# Altium schematic sheet [16]-SP1_TYPEC_PWR_IN.SchDoc: RK3399 SOM Board Design V1.0
size A4; Author: AVIRAL MISHRA; DocumentNumber: 18; SheetNumber: 18; SheetTotal: 21; PROJECT CODE: A_V1.0
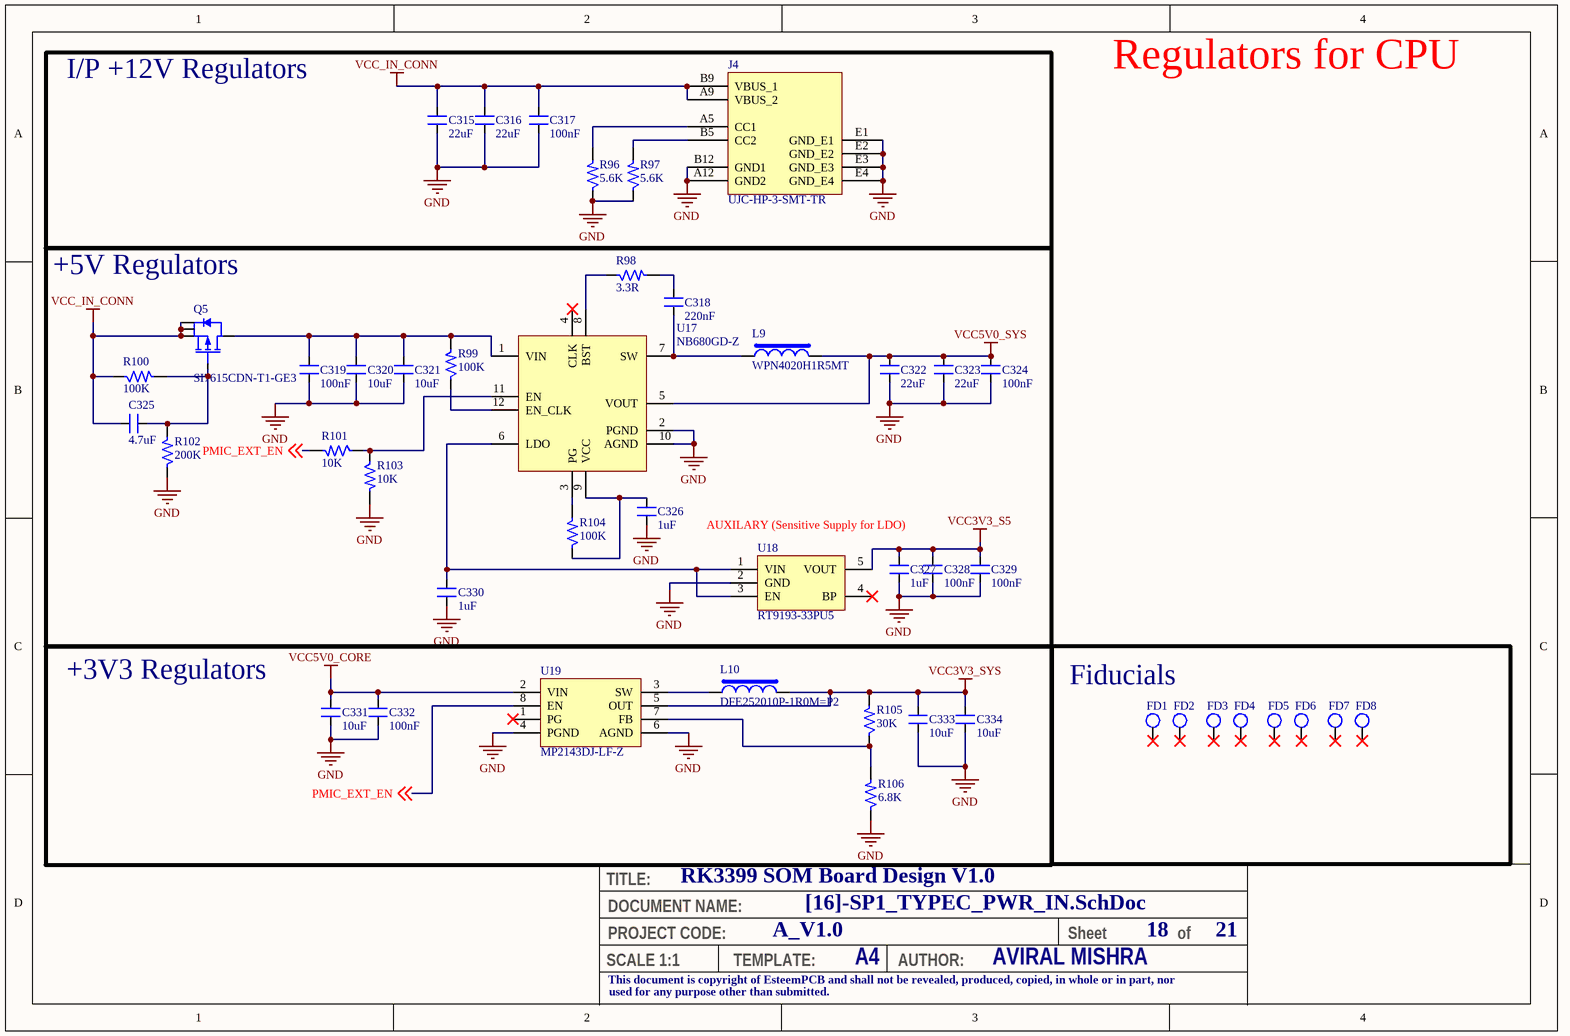
[diagram p0: [16]-SP1_TYPEC_PWR_IN.SchDoc]

## Parts
C315  22uF  [CAP_0603]
C316  22uF  [CAP_0603]
C317  100nF  [CAP_0402]
C318  220nF  [CAP_0402]
C319  100nF  [CAP_0402]
C320  10uF  [CAP_0402]
C321  10uF  [CAP_0402]
C322  22uF  [CAP_0603]
C323  22uF  [CAP_0603]
C324  100nF  [CAP_0402]
C325  4.7uF  [CAP_0402]
C326  1uF  [CAP_0402]
C327  1uF  [CAP_0402]
C328  100nF  [CAP_0402]
C329  100nF  [CAP_0402]
C330  1uF  [CAP_0402]
C331  10uF  [CAP_0402]
C332  100nF  [CAP_0402]
C333  10uF  [CAP_0402]
C334  10uF  [CAP_0402]
FD1  Fiducial  [FIDUCIAL_78.7MIL]  (value not drawn)
FD2  Fiducial  [FIDUCIAL_78.7MIL]  (value not drawn)
FD3  Fiducial  [FIDUCIAL_78.7MIL]  (value not drawn)
FD4  Fiducial  [FIDUCIAL_78.7MIL]  (value not drawn)
FD5  Fiducial  [FIDUCIAL_78.7MIL]  (value not drawn)
FD6  Fiducial  [FIDUCIAL_78.7MIL]  (value not drawn)
FD7  Fiducial  [FIDUCIAL_78.7MIL]  (value not drawn)
FD8  Fiducial  [FIDUCIAL_78.7MIL]  (value not drawn)
J4  UJC-HP-3-SMT-TR  [CON6_48.4_UJC-HP-3-SMT-TR]
L9  WPN4020H1R5MT  [IND_1616]
L10  DFE252010P-1R0M=P2  [IND_1008]
Q5  SI7615CDN-T1-GE3  [PowerPAK_1212-8_SMD]
R96  5.6K  [RES_0402]
R97  5.6K  [RES_0402]
R98  3.3R  [RES_0402]
R99  100K  [RES_0402]
R100  100K  [RES_0402]
R101  10K  [RES_0402]
R102  200K  [RES_0402]
R103  10K  [RES_0402]
R104  100K  [RES_0402]
R105  30K  [RES_0402]
R106  6.8K  [RES_0402]
U17  NB680GD-Z  [QFN-12_19_118X118_SMD]
U18  RT9193-33PU5  [SC70-5]
U19  MP2143DJ-LF-Z  [SOT23-8]

## Blocks framed on the sheet
I/P +12V Regulators: C315-C317 J4 R96 R97
+5V Regulators: C318-C330 L9 Q5 R98-R104 U17 U18
+3V3 Regulators: C331-C334 L10 R105 R106 U19
Fiducials: FD1-FD8

## Nets
GND: C315.1 C316.1 C317.1 C319.1 C320.1 C321.1 C322.1 C323.1 C324.1 C326.1 C327.1 C328.1 C329.1 C330.1 C331.1 C332.1 C333.1 C334.1 J4.A12(GND2) J4.B12(GND1) J4.E1(GND_E1) J4.E2(GND_E2) J4.E3(GND_E3) J4.E4(GND_E4) R96.1 R97.1 R102.1 R103.2 R106.1 U17.2(PGND) U17.10(AGND) U18.2(GND) U19.4(PGND) U19.6(AGND)
VCC3V3_S5: C327.2 C328.2 C329.2 U18.5(VOUT)
VCC3V3_SYS: C333.2 C334.2 L10.2 R105.2 U19.5(OUT)
VCC5V0_CORE: C331.2 C332.2 U19.2(VIN)
VCC5V0_SYS: C322.2 C323.2 C324.2 L9.2 U17.5(VOUT)
VCC_IN_CONN: C315.2 C316.2 C317.2 C325.1 J4.A9(VBUS_2) J4.B9(VBUS_1) Q5.1(S) Q5.2(S) Q5.3(S) R100.1
PMIC_EXT_EN: R101.2 U19.8(EN) ; off-sheet PMIC_EXT_EN
NetC318_1: C318.1 L9.1 U17.7(SW)
NetC318_2: C318.2 R98.2
NetC319_2: C319.2 C320.2 C321.2 Q5.5(D) R99.2 U17.1(VIN)
NetC325_2: C325.2 Q5.4(G) R100.2 R102.2
NetC326_2: C326.2 R104.1 U17.9(VCC)
NetC330_2: C330.2 U17.6(LDO) U18.1(VIN) U18.3(EN)
NetJ4_A5: J4.A5(CC1) R96.2
NetJ4_B5: J4.B5(CC2) R97.2
NetL10_1: L10.1 U19.3(SW)
NetR98_1: R98.1 U17.8(BST)
NetR99_1: R99.1 U17.12(EN_CLK)
NetR101_1: R101.1 R103.1 U17.11(EN)
NetR104_2: R104.2 U17.3(PG)
NetR105_1: R105.1 R106.2 U19.7(FB)

Not connected (* = marked no-connect by the designer): FD1 1*; FD2 1*; FD3 1*; FD4 1*; FD5 1*; FD6 1*; FD7 1*; FD8 1*; U17 4(CLK)*; U18 4(BP)*; U19 1(PG)*

## Notes on the sheet
- Regulators for CPU
- AUXILARY (Sensitive Supply for LDO)
- TITLE:
- DOCUMENT NAME:
- SCALE 1:1
- This document is copyright of EsteemPCB and shall not be revealed, produced, copied, in whole or in part, nor
- PROJECT CODE:
- TEMPLATE:
- A4
- AUTHOR:
- Sheet
- of
- used for any purpose other than submitted.

## Library data of the parts
C315 C316 C322 C323 = CAP_22uF-10V-20%-0603: 22µF ±20% 10V Ceramic Capacitor X5R 0603 (1608 Metric) /; Manufacturer: Murata Electronics; Manufacturer Part Number: GRM188R61A226ME15D; Case/Package: 0603; Supplier-1: Digikey
C317 C319 C324 C328 C329 C332 = CAP_100nF-25V-10%-0402: 0.1µF ±10% 25V Ceramic Capacitor X7R 0402 (1005 Metric) /; Manufacturer: Walsin Technology Corporation; Manufacturer Part Number: 0402B104K250CT; Case/Package: 0402; Supplier-1: Digikey
C318 = CAP_220nF-10V-10%-0402: 0.22µF ±10% 10V Ceramic Capacitor X7R 0402 (1005 Metric) /; Manufacturer: Samsung Electro-Mechanics; Manufacturer Part Number: CL05B224KP5NNNC; Case/Package: 0402; Supplier-1: Digikey
C320 C321 C331 C333 C334 = CAP_10uF-10V-20%-0402: 10µF ±20% 10V Ceramic Capacitor X5R 0402 (1005 Metric) /; Manufacturer Part Number: CL05A106MP5NUNC; Manufacturer: Samsung Electro-Mechanics; Case/Package: 0402; Supplier-1: Digikey
C325 = CAP_4.7uF-10V-10%-0402: 4.7µF ±10% 10V Ceramic Capacitor X5R 0402 (1005 Metric) /; Manufacturer: Samsung Electro-Mechanics; Manufacturer Part Number: CL05A475KP5NRNC; Case/Package: 0402; Supplier-1: Digikey
C326 C327 C330 = CAP_1uF-16V-10%-0402: 1µF ±10% 16V Ceramic Capacitor X5R 0402 (1005 Metric) /; Manufacturer: Knowles Novacap; Manufacturer Part Number: 0402BW105K160YT; Case/Package: 0402; Supplier-1: Digikey
FD1-FD8 = Fiducials_78.7mil: 78.7mil Fiducials SMD; Manufacturer: NA; Nymble Part Number: 1EA-AA-0523; Manufacturer Part Number: NA; Case/Package: SMD; Supplier-1: NA; Supplier Part Number-1: NA; Alternate Part Number-1: NA; Category: Fiducial; Number of Pins: 1
J4 = CON-TYPEC_6X1-100-RA-TH: USB Connectors USB jack, C type, power only, 6 pin, horizonal, gold flash plating, surface mount, T&R; Manufacturer: CUI Devices; Manufacturer Part Number: UJC-HP-3-SMT-TR; Case/Package: TH; Supplier-1: Mouser
L9 = IND_1.5uH-6A-20%-SMD: Wire Wound SMD Power Inductors – WPN Series / Operating Temp. : -40℃~+125℃ (Including self-heating) /; Manufacturer: Sunlord; Mnaufcaturer Part Number: WPN4020H1R5MT; Case/Package: SMD; Supplier-1: NA
L10 = IND_1uH-3.8A-20%-1008: 1µH Shielded Wirewound Inductor 3.8A 54mOhm Max 1008 (2520 Metric) /; Manufacturer: Murata Electronics; Manufacturer Part Number: DFE252010P-1R0M=P2; Case/Package: 1008; Supplier-1: Digikey
Q5 = MOSFET-P_20V-35A-1212-8: P-Channel 20V 35A (Tc) 33W (Tc) Surface Mount PowerPAK® 1212-8 /; Manufacturer: Vishay Siliconix; Manufacturer Part Number: SI7615CDN-T1-GE3; Case/Package: PowerPAK® 1212-8; Supplier-1: Digikey
R96 R97 = RES_5.6K-0.1W-1%-0402: 5.6 kOhms ±1% 0.1W, 1/10W Chip Resistor 0402 (1005 Metric) Automotive AEC-Q200, Moisture Resistant Thick Film /; Manufacturer: KOA Speer Electronics, Inc.; Manufacturer Part Number: RK73H1ETTP5601F; Case/Package: 0402; Supplier-1: Digikey
R98 = RES_3.3R-0.1W-1%-0402: 3.3 Ohms ±1% 0.1W, 1/10W Chip Resistor 0402 (1005 Metric) Anti-Sulfur, Automotive AEC-Q200 Thick Film /; Manufacturer: Panasonic Electronic Components; Manufacturer Part Number: ERJ-U02F3R30X; Case/Package: 0402; Supplier-1: Digikey
R99 R100 R104 = RES_100K-0.1W-1%-0402: 100 kOhms ±1% 0.1W, 1/10W Chip Resistor 0402 (1005 Metric) Anti-Sulfur Thin Film /; Manufacturer: Vishay Beyschlag/Draloric/BC Components; Manufacturer Part Number: MCS04020C1003FE000; Case/Package: 0402; Supplier-1: Digikey
R101 R103 = RES_10K-0.1W-1%-0402: 10 kOhms ±1% 0.1W, 1/10W Chip Resistor 0402 (1005 Metric) Anti-Sulfur Thin Film /; Manufacturer: Vishay Beyschlag/Draloric/BC Components; Manufacturer Part Number: MCS04020C1002FE000; Case/Package: 0402; Supplier-1: Digikey
R102 = RES_200K-0.1W-1%-0402: 200 kOhms ±1% 0.1W, 1/10W Chip Resistor 0402 (1005 Metric) Automotive AEC-Q200 Thick Film /; Manufacturer: Panasonic Electronic Components; Manufacturer Part number: ERJ-2RKF2003X; Case/Package: 0402; Supplier-1: Digikey
R105 = RES_30K-0.1W-1%-0402: 30 kOhms ±1% 0.1W, 1/10W Chip Resistor 0402 (1005 Metric) Automotive AEC-Q200, Moisture Resistant Thick Film /; Manufacturer: KOA Speer Electronics, Inc.; Manufacturer Part Number: RK73H1ETTP3002F; Case/Package: 0402; Supplier-1: Digikey
R106 = RES_6.8K-0.1W-1%-0402: 6.8 kOhms ±1% 0.1W, 1/10W Chip Resistor 0402 (1005 Metric) Anti-Sulfur Thin Film /; Manufacturer Part Number: MCS04020C6801FE000; Manufacturer: Vishay Beyschlag/Draloric/BC Components; Case/Package: 0402; Supplier-1: Digikey
U17 = REG_3.3V-26V-8A-QFN-12: Switching Voltage Regulators 26V Fixed 3.3 V-8A Sync Buck Converter; Manufacturer: Monolithic Power Systems (MPS); Manufacturer Part Number: NB680GD-Z; Case/Package: QFN-12; Supplier-1: Mouser
U18 = REG_3.3V-5.5V-300mA-SC-70-5: SC-70-5 Dropout Regulators(LDO) RoHS; Manufacturer: Richtek Tech; Manufacturer Part Number: RT9193-33PU5; Case/Package: SC-70-5; Supplier-1: LCSC
U19 = REG_0.6~5V-5.5V-3A-TSOT-23-8: Switching Voltage Regulators 3A, 5.5V, 1.2MHz Sync Stp-Dwn Swtchr; Manufacturer: Monolithic Power Systems (MPS); Manufacturer Part Number: MP2143DJ-LF-Z; Case/Package: TSOT-23-8; Supplier-1: Mouser